# Altium schematic sheet ft311d.SchDoc
size A4
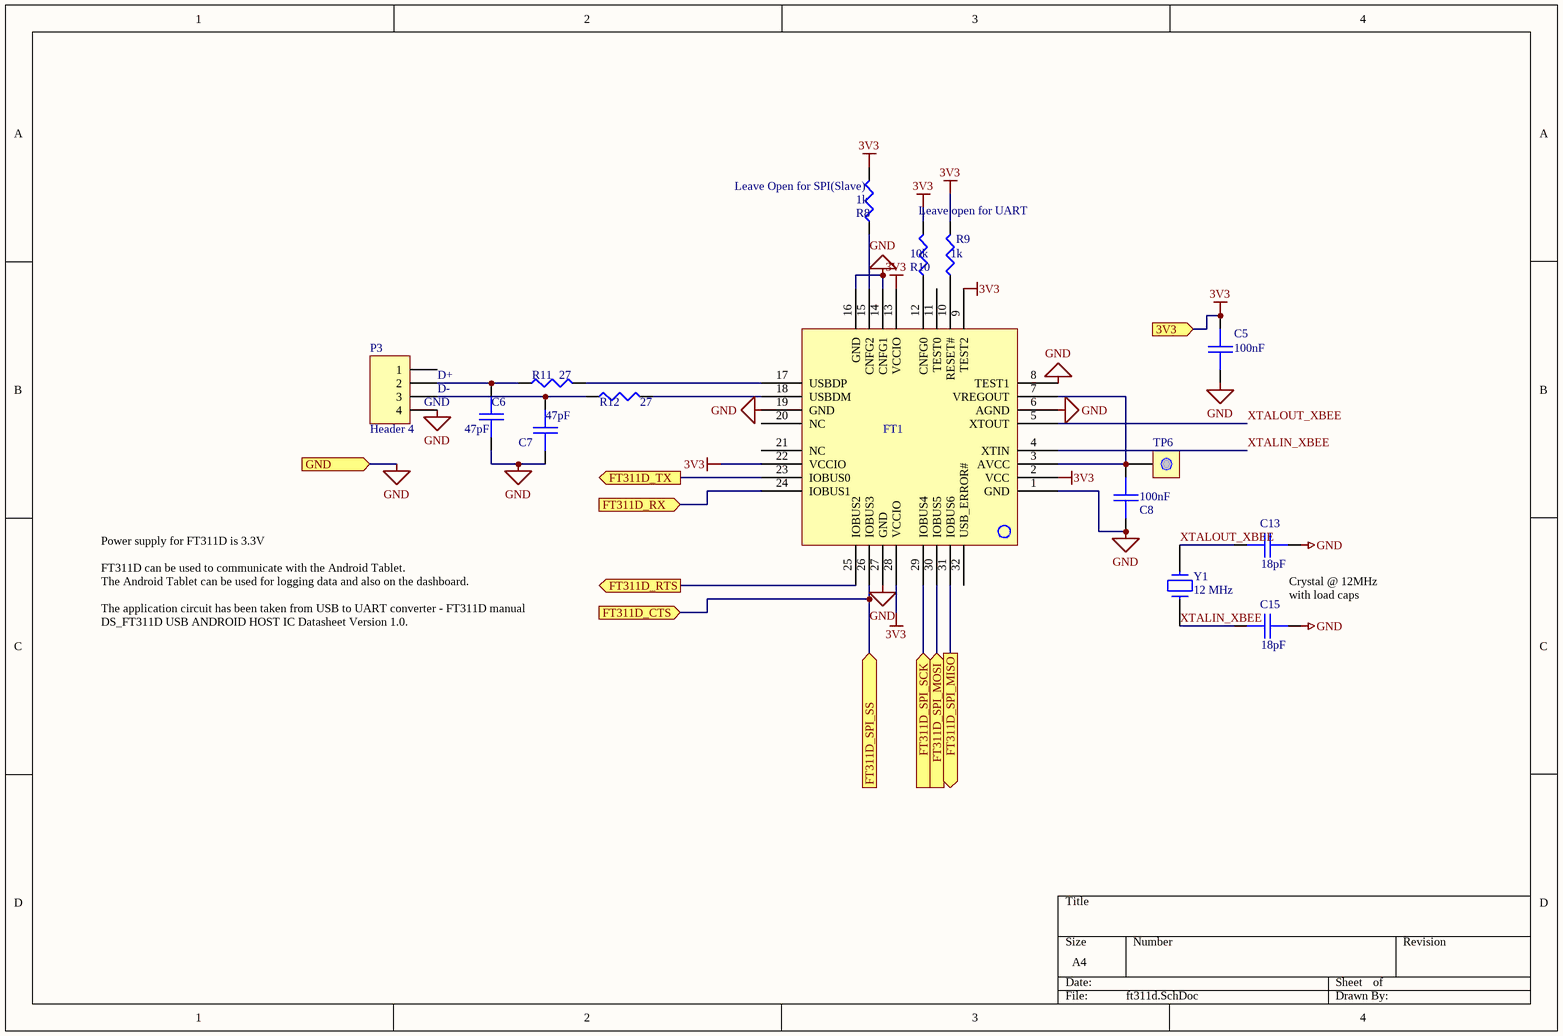
[diagram p0: ft311d.SchDoc]

## Parts
C5  value 100nF  [0603]  (hidden comment: CAP)
C6  value 47pF  [0603]  (hidden comment: CAP)
C7  value 47pF  [0603]  (hidden comment: CAP)
C8  value 100nF  [0603]  (hidden comment: CAP)
C13  value 18pF  [0603]  (hidden comment: CAP)
C15  value 18pF  [0603]  (hidden comment: CAP)
FT1  FT311D  [QFP32]  (value not drawn)
P3  Header 4  [HDR1X4]
R8  Leave Open for SPI(Slave)  value 1k  [0603]
R9  value 1k  [0603]  (hidden comment: RES1)
R10  Leave open for UART  value 10k  [0603]
R11  27  [0603]
R12  value 27  [0603]  (hidden comment: RES1)
TP6  TP_AVCC  [TESTPOINT]  (value not drawn)
Y1  12 MHz  [HC49/4H]

## Ports
3V3 (in), FT311D_CTS (in), FT311D_RTS (out), FT311D_RX (in), FT311D_SPI_MISO (out), FT311D_SPI_MOSI (in), FT311D_SPI_SCK (in), FT311D_SPI_SS (in), FT311D_TX (out), GND (in)

## Nets
3V3: C5.1 FT1.2(VCC) FT1.9(TEST2) FT1.13(VCCIO) FT1.22(VCCIO) FT1.28(VCCIO) R8.2 R9.2 R10.2 ; port 3V3
GND: C5.2 C6.2 C7.2 C8.2 C13.2 C15.2 FT1.1(GND) FT1.6(AGND) FT1.8(TEST1) FT1.14(CNFG1) FT1.16(GND) FT1.19(GND) FT1.27(GND) P3.4 ; port GND
FT311D_CTS: FT1.26(IOBUS3) ; port FT311D_CTS, port FT311D_SPI_SS
FT311D_RTS: FT1.25(IOBUS2) ; port FT311D_RTS
FT311D_RX: FT1.24(IOBUS1) ; port FT311D_RX
FT311D_SPI_MISO: FT1.31(IOBUS6) ; port FT311D_SPI_MISO
FT311D_SPI_MOSI: FT1.30(IOBUS5) ; port FT311D_SPI_MOSI
FT311D_SPI_SCK: FT1.29(IOBUS4) ; port FT311D_SPI_SCK
FT311D_TX: FT1.23(IOBUS0) ; port FT311D_TX
XTALIN_XBEE: C15.1 FT1.4(XTIN) Y1.1
XTALOUT_XBEE: C13.1 FT1.5(XTOUT) Y1.2
NetC6_1: C6.1 P3.2 R11.1
NetC7_1: C7.1 P3.3 R12.1
NetC8_1: C8.1 FT1.3(AVCC) FT1.7(VREGOUT) TP6.0(TP)
NetFT1_10: FT1.10(RESET#) R9.1
NetFT1_12: FT1.12(CNFG0) R10.1
NetFT1_15: FT1.15(CNFG2) R8.1
NetFT1_17: FT1.17(USBDP) R11.2
NetFT1_18: FT1.18(USBDM) R12.2

Not connected (* = marked no-connect by the designer): FT1 11(TEST0) 20(NC) 21(NC) 32(USB_ERROR#); P3 1

## Notes on the sheet
- D+
- (near P3) GND
- D-
- Power supply for FT311D is 3.3V
  FT311D can be used to communicate with the Android Tablet.
  The Android Tablet can be used for logging data and also on the dashboard.
  The application circuit has been taken from USB to UART converter - FT311D manual
  DS_FT311D USB ANDROID HOST IC Datasheet Version 1.0.
- Crystal @ 12MHz with load caps

## Library data of the parts
C5 C8 C13 C15 = CAP: Capacitor
C6 C7 = CAP1: Capacitor
FT1 = FT311D: USB ANDROID Host IC; Manufacturer Part No: FT311D-32L1C-R-IC; Digital IC Case Style: LQFP; Farnell (09/02/2013): $6.08
P3 = Header 4: Header, 4-Pin; LatestRevisionDate: 17-Jul-2002; LatestRevisionNote: Re-released for DXP Platform.; Publisher: Altium Limited
R8-R12 = RES1: Resistor
  R11: Value: 27
TP6 = TEST: TEST POINT
Y1 = CRYSTAL: Needed?: RS; RS: 693-8803; RS Price: 0.95